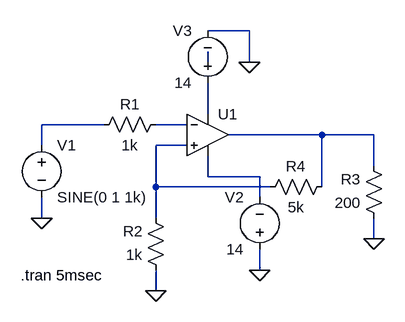
[diagram p0: schematic exp_1_electro.asc]
exp_1_electro.asc, the LTspice schematic file:
Version 4
SHEET 1 884 680
WIRE 528 -16 464 -16
WIRE 464 32 464 16
WIRE 528 32 528 -16
WIRE 464 112 464 64
WIRE 304 128 208 128
WIRE 432 128 384 128
WIRE 640 144 496 144
WIRE 720 144 640 144
WIRE 208 160 208 128
WIRE 432 160 384 160
WIRE 720 192 720 144
WIRE 464 208 464 176
WIRE 544 208 464 208
WIRE 384 224 384 160
WIRE 560 224 384 224
WIRE 640 224 640 144
WIRE 544 240 544 208
WIRE 208 272 208 240
WIRE 384 272 384 224
WIRE 720 304 720 272
WIRE 544 352 544 320
WIRE 384 384 384 352
FLAG 208 272 0
FLAG 544 352 0
FLAG 720 304 0
FLAG 384 384 0
FLAG 528 32 0
SYMBOL voltage 208 144 R0
WINDOW 123 0 0 Left 0
WINDOW 39 0 0 Left 0
SYMATTR InstName V1
SYMATTR Value SINE(0 1 1k)
SYMBOL voltage 544 336 R180
WINDOW 0 24 96 Left 2
WINDOW 3 24 16 Left 2
WINDOW 123 0 0 Left 0
WINDOW 39 0 0 Left 0
SYMATTR InstName V2
SYMATTR Value 14
SYMBOL voltage 464 80 R180
WINDOW 0 24 96 Left 2
WINDOW 3 24 16 Left 2
WINDOW 123 0 0 Left 0
WINDOW 39 0 0 Left 0
SYMATTR InstName V3
SYMATTR Value 14
SYMBOL res 400 112 R90
WINDOW 0 0 56 VBottom 2
WINDOW 3 32 56 VTop 2
SYMATTR InstName R1
SYMATTR Value 1k
SYMBOL res 400 368 R180
WINDOW 0 36 76 Left 2
WINDOW 3 36 40 Left 2
SYMATTR InstName R2
SYMATTR Value 1k
SYMBOL res 736 288 R180
WINDOW 0 36 76 Left 2
WINDOW 3 36 40 Left 2
SYMATTR InstName R3
SYMATTR Value 200
SYMBOL res 544 240 R270
WINDOW 0 32 56 VTop 2
WINDOW 3 0 56 VBottom 2
SYMATTR InstName R4
SYMATTR Value 5k
SYMBOL Opamps\\UniversalOpamp2 464 144 R0
SYMATTR InstName U1
TEXT 176 360 Left 2 !.tran 5msec

The netlist it stands for:
* exp_1_electro.asc
V1 N003 0 SINE(0 1 1k)
V2 0 N007 14
V3 N002 0 14
R1 N004 N003 1k
R2 0 N006 1k
R3 0 N005 200
R4 N006 N005 5k
XU1 N006 N004 N002 N007 N005 level.2 Avol=1Meg GBW=10Meg Slew=10Meg ilimit=25m rail=0 Vos=0 phimargin=45 en=0 enk=0 in=0 ink=0 Rin=500Meg  ; pins IN+ IN- V+ V- OUT
.tran 5msec
.lib UniversalOpamps2.sub
.backanno
.end